# EAGLE design CARTE E-STOP (EAGLE 9.2.2)
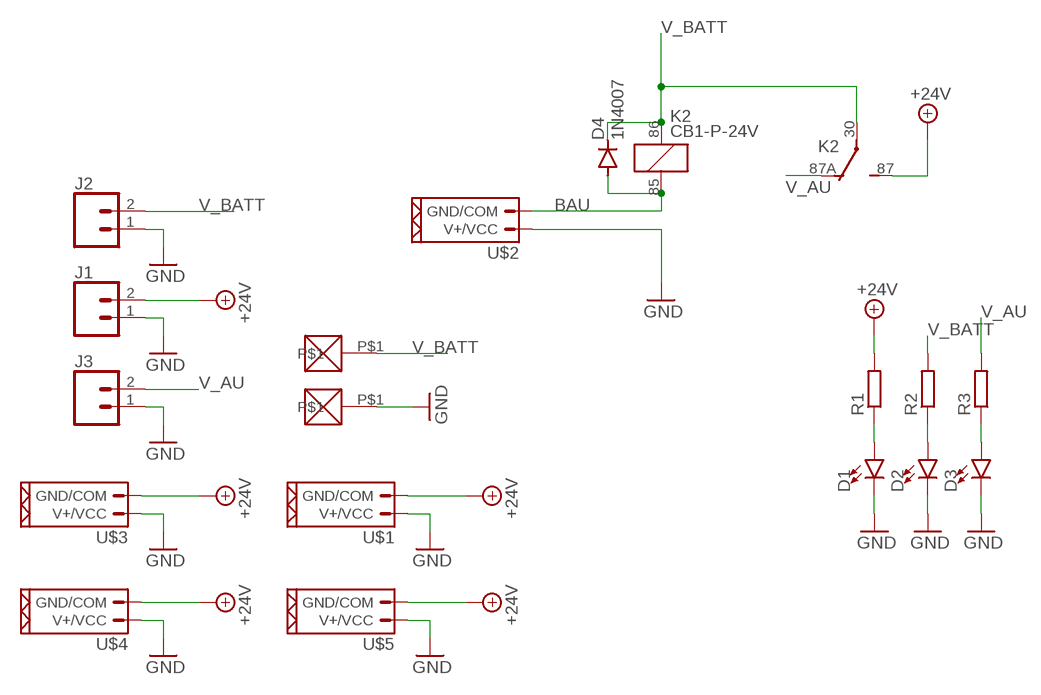
[diagram p0: schematic, sheet 1]

## Parts
D1  LED3MM  [LED_3MM]
D2  LED3MM  [LED_3MM]
D3  LED3MM  [LED_3MM]
D4  1N4007  1N4004  [DO41-10]
GND_BATT  BAT_WIRE_SOLD  [LARGE_PAD_BATT]
J1  CONN_02POLAR  [MOLEX-1X2]
J2  CONN_02POLAR  [MOLEX-1X2]
J3  CONN_02POLAR  [MOLEX-1X2]
K2  CB1-P-24V  [CB1]
R1  R-EU_0207/2V  [0207/2V]
R2  R-EU_0207/2V  [0207/2V]
R3  R-EU_0207/2V  [0207/2V]
U$1  CONN_02_PUI  [NSK396-2C]
U$2  CONN_02_PUI  [NSK396-2C]
U$3  CONN_02_PUI  [NSK396-2C]
U$4  CONN_02_PUI  [NSK396-2C]
U$5  CONN_02_PUI  [NSK396-2C]
V+BATT  BAT_WIRE_SOLD  [LARGE_PAD_BATT]

## Nets
+24V: J1.2 K2.87(2:S) R1.2 U$1.P$1(GND/COM) U$3.P$1(GND/COM) U$4.P$1(GND/COM) U$5.P$1(GND/COM)
BAU: D4.A K2.85 U$2.P$1(GND/COM)
GND: D1.K(C) D2.K(C) D3.K(C) GND_BATT.P$1 J1.1 J2.1 J3.1 U$1.P$2(V+/VCC) U$2.P$2(V+/VCC) U$3.P$2(V+/VCC) U$4.P$2(V+/VCC) U$5.P$2(V+/VCC)
N$1: D1.A R1.1
N$2: D2.A R2.1
N$3: D3.A R3.1
V_AU: J3.2 K2.87A(2:O) R3.2
V_BATT: D4.C J2.2 K2.30(2:P) K2.86 R2.2 V+BATT.P$1

## Library data of the parts
D1-D3 = OPENBOT:LED: LED (Generic) Standard schematic elements and footprints for 5mm, 3mm, 1206, and 0603 sized LEDs. Generic LEDs with no color specified.; PROD_ID: DIO-08794
D4 = diode:1N4004: DIODE general purpose rectifier, 1 A
GND_BATT V+BATT = KARIBOUS:BAT_WIRE_SOLD
J1-J3 = OPENBOT:CONN_02: Multi connection point. Often used as Generic Header-pin footprint for 0.1 inch spaced/style header connections On any of the 0.1 inch spaced packages, you can populate with these: Break Away Headers - Straight <https://www.sparkfun.com/products/116> (PRT-00116) Break Away Male Headers - Right Angle <https://www.sparkfun.com/products/553> (PRT-00553) Female Headers <https://www.sparkfun.com/products/115> (PRT-00115) Break Away Headers - Machine Pin <https://www.sparkfun.com/products/117> (PRT-00117) Break Away Female Headers - Swiss Machine Pin <https://www.sparkfun.com/products/743> (PRT-00743) For SCREWTERMINALS and SPRING TERMINALS visit here: Screw Terimnals on SparkFun.com <https://www.sparkfun.com/search/results?term=Screw+Terminals> (5mm/3.5mm/2.54mm spacing) This device is also useful as a general connection point to wire up your design to another part of your project. Our various solder wires solder well into these plated through hole pads. Hook-Up Wire - Assortment (Stranded, 22 AWG) <https://www.sparkfun.com/products/11375> (PRT-11375) Hook-Up Wire - Assortment (Solid Core, 22 AWG) <https://www.sparkfun.com/products/11367> (PRT-11367) View the entire wire category on our website here <https://www.sparkfun.com/categories/141> Special notes: Molex polarized connector foot print use with: PRT-08233 with associated crimp pins and housings. 2.54_SCREWTERM for use with PRT-10571. 3.5mm Screw Terminal footprints for PRT-08084 5mm Screw Terminal footprints for use with PRT-08432 Multi connection point. Often used as Generic Header-pin footprint for 0.1 inch spaced/style header connections On any of the 0.1 inch spaced packages, you can populate with these: Break Away Headers - Straight <https://www.sparkfun.com/products/116> (PRT-00116) Break Away Male Headers - Right Angle <https://www.sparkfun.com/products/553> (PRT-00553) Female Headers <https://www.sparkfun.com/products/115> (PRT-00115) Break Away Headers - Machine Pin <https://www.sparkfun.com/products/117> (PRT-00117) Break Away Female Headers - Swiss Machine Pin <https://www.sparkfun.com/products/743> (PRT-00743) For SCREWTERMINALS and SPRING TERMINALS visit here: Screw Terimnals on SparkFun.com <https://www.sparkfun.com/search/results?term=Screw+Terminals> (5mm/3.5mm/2.54mm spacing) This device is also useful as a general connection point to wire up your design to another part of your project. Our various solder wires solder well into these plated through hole pads. Hook-Up Wire - Assortment (Stranded, 22 AWG) <https://www.sparkfun.com/products/11375> (PRT-11375) Hook-Up Wire - Assortment (Solid Core, 22 AWG) <https://www.sparkfun.com/products/11367> (PRT-11367) View the entire wire category on our website here <https://www.sparkfun.com/categories/141> Special notes: Molex polarized connector foot print use with: PRT-08233 with associated crimp pins and housings. 2.54_SCREWTERM for use with PRT-10571. 3.5mm Screw Terminal footprints for PRT-08084 5mm Screw Terminal footprints for use with PRT-08432; SF_ID: PRT-09918
K2 = relay:CB1*: HIGH POWER AUTOMOTIVE RELAY Form C NAiS Source: http://www.mew-europe.com/.. en_ds_61202_0000.pdf; MF: AROMAT/ MATSUSHITA; MPN: CB1-P-24V; OC_FARNELL: 4168987; OC_NEWARK: 07C0827
R1-R3 = rcl:R-EU_: RESISTOR, European symbol; SPICEPREFIX: R
U$1-U$5 = OPENBOT:CONN_02_PUI

## Board
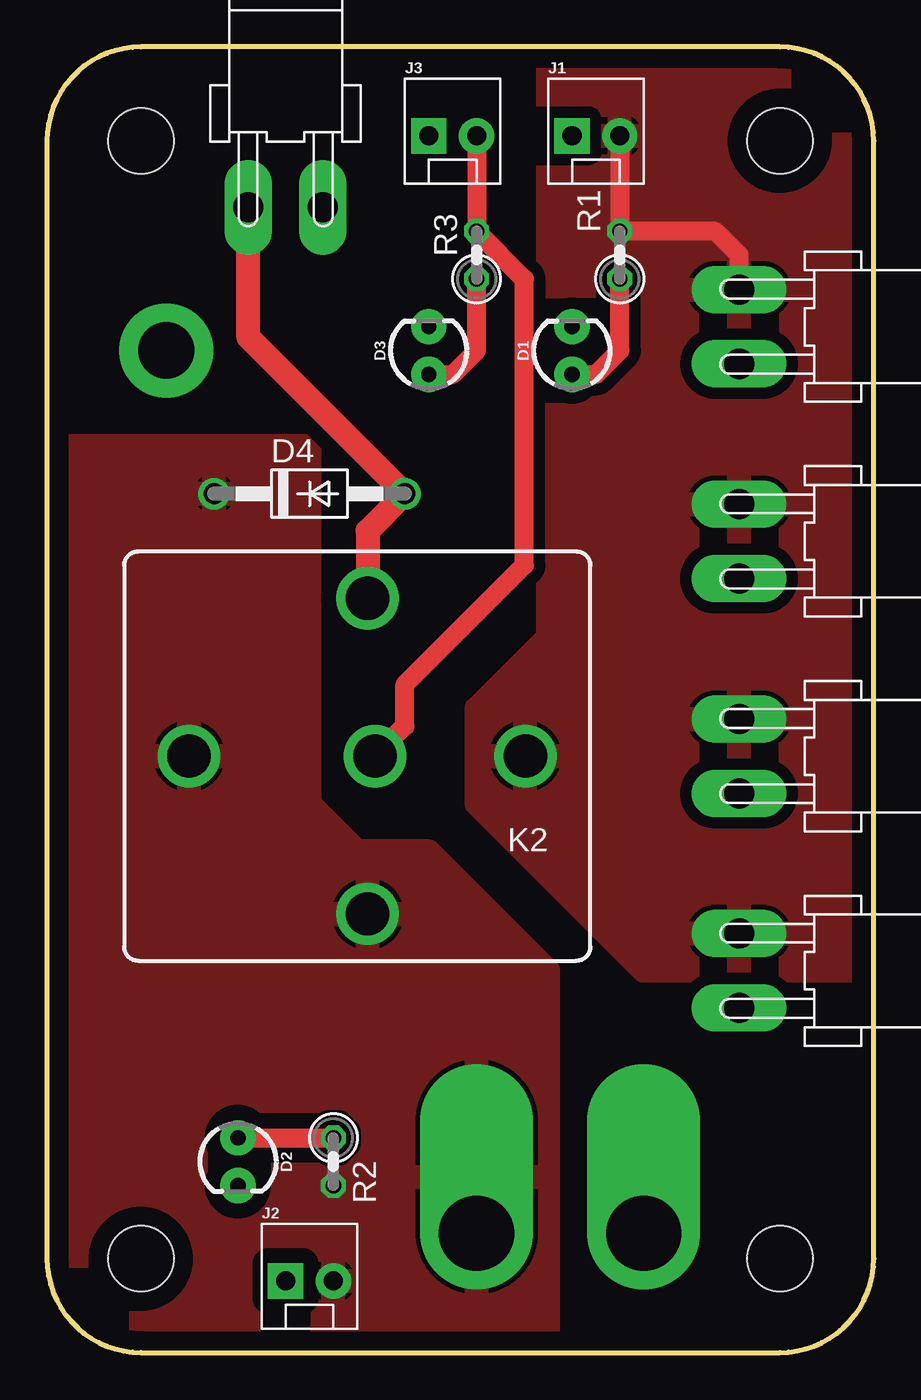
[diagram p1: board, top side]
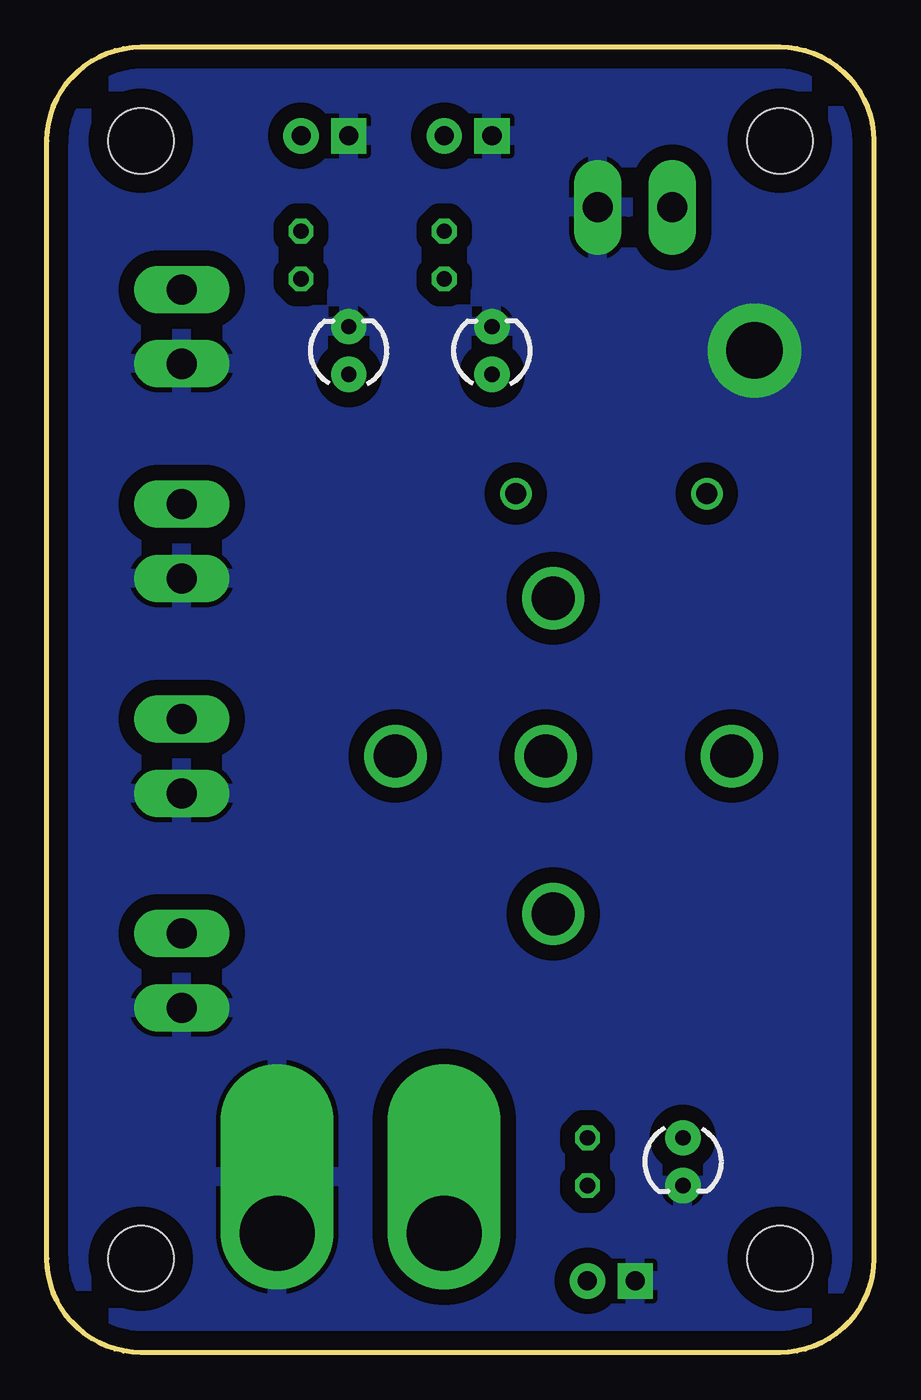
[diagram p2: board, bottom side, seen from below]

Size 44 x 69.5 mm. Coordinates in mm from the lower left corner, seen from the top.
Outline: 0,5 arc90 5,0 39,0 arc90 44,5 44,64.5 arc90 39,69.5 5,69.5 arc90 0,64.5 0,5
Copper layers (1*16): Top 0.035mm / dielectric 1.5mm / Bottom 0.035mm
Design rules "default": minimum track width 6mil, minimum drill 0.35mm, track to track 6mil, track to pad 6mil, pad to pad 6mil, via to via 6mil, smd to smd 6mil, copper to edge 40mil, drill to drill 6mil, minimum pad ring 10mil, minimum via ring 8mil, stop-mask expansion 4mil, vias tented up to drill 0mil, thermal gap 10mil
Holes 3.5 mm at 5,64.5 39,64.5 39,5 5,5

### Footprints (pad centres in the part's own frame; a part is rotated, then mirrored left to right if it is on the bottom)
LED_3MM = drill 0.813 pad 1.88: A -1.27,0; K 1.27,0
DO41-10 = drill 1.118: A 5.08,0; C -5.08,0
LARGE_PAD_BATT = drill 4 pad 6 offset: P$1 0,0
MOLEX-1X2 = drill 1.016 pad 1.88 square: 1 0,0 | drill 1.016 pad 1.88: 2 2.54,0
CB1 = drill 2.3: 30 8.95,0; 85 -0.55,-8.4; 86 -0.55,8.4; 87 -8.95,0; 87A -0.95,0
0207/2V = drill 0.813 octagon: 1 -1.27,0; 2 1.27,0
NSK396-2C = drill 1.6 pad 2.54 long: P$1 -1.98,0; P$2 1.98,0

### Placement (x,y rotation side)
D1  27.94,53.34 90 top
D2  10.16,10.16 270 top
D3  20.32,53.34 90 top
D4  13.97,45.72 0 top
GND_BATT  31.75,6.35 0 top
J1  27.94,64.77 0 top
J2  12.7,3.81 0 top
J3  20.32,64.77 0 top
K2  16.51,31.75 180 top
R1  30.48,58.42 90 top
R2  15.24,10.16 270 top
R3  22.86,58.42 90 top
U$1  36.83,20.32 270 top
U$2  12.7,60.96 0 top
U$3  36.83,54.61 270 top
U$4  36.83,43.18 270 top
U$5  36.83,31.75 270 top
V+BATT  22.86,6.35 0 top

### Tracks (layer width: path | path; a pad name or v marks a point on that pad's centre or on a via)
+24V
  Top 1.016: J1.2 R1.2 35.56,59.69 36.83,58.42 U$3.P$1
  pour Top (isolate 0.61): 44.45,20.32 31.75,20.32 22.86,29.21 22.86,34.29 26.67,38.1 26.67,69.85 44.45,69.85
BAU
  Top 1.27: K2.85 17.06,43.73 D4.A 10.72,54.05 U$2.P$1
GND  (via drill 3 pad 5)
  other vias: 6.35,53.34
  pour Bottom (isolate 0.813): 0,69.85 44.45,69.85 44.45,0 0,0
N$1
  Top 1.016: D1.A 29.21,52.07 30.48,53.34 R1.1
N$2
  Top 1.016: D2.A R2.1
N$3
  Top 1.016: D3.A 21.59,52.07 22.86,53.34 R3.1
V_AU
  Top 1.016: J3.2 R3.2 25.4,57.15 25.4,41.91 19.05,35.56 19.05,33.34 K2.87A
V_BATT
  pour Top (isolate 0.813): 26.67,0 26.67,20.32 20.32,26.67 16.51,26.67 13.97,29.21 13.97,48.26 0,48.26 0,0